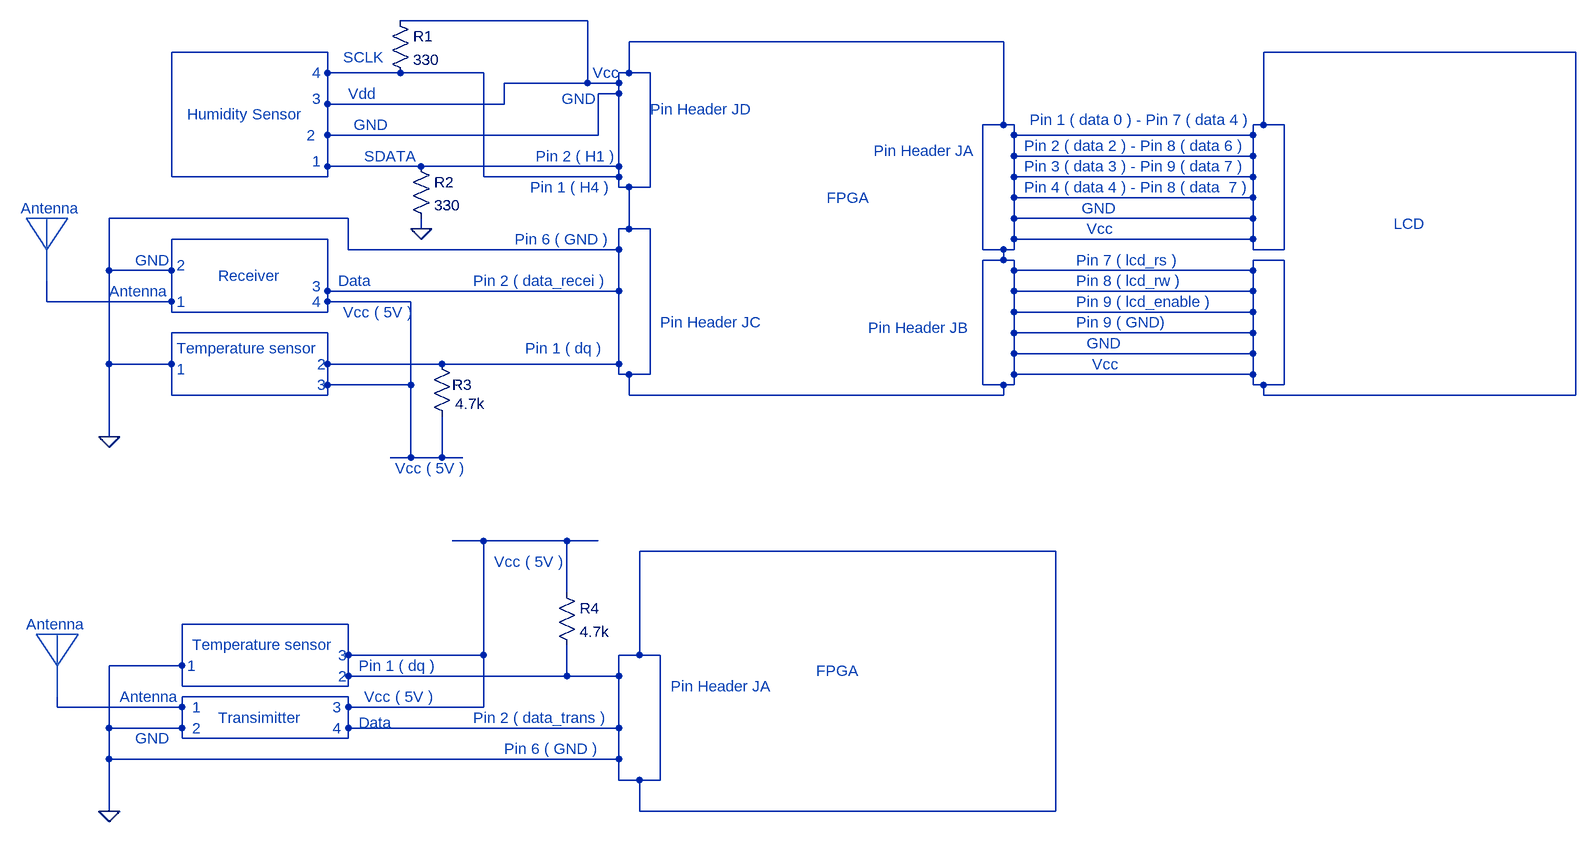
[diagram p0: schematic all_circuit_diagram.asc]
all_circuit_diagram.asc, the LTspice schematic file:
Version 4
SHEET 1 2196 1492
WIRE 672 -112 384 -112
WIRE 1312 -80 736 -80
WIRE 272 -64 32 -64
WIRE 2192 -64 1712 -64
WIRE 272 -32 272 -64
WIRE 384 -32 272 -32
WIRE 512 -32 384 -32
WIRE 736 -32 736 -80
WIRE 736 -32 720 -32
WIRE 768 -32 736 -32
WIRE 672 -16 672 -112
WIRE 672 -16 544 -16
WIRE 720 -16 720 -32
WIRE 720 -16 672 -16
WIRE 720 0 720 -16
WIRE 720 0 688 0
WIRE 272 16 272 -32
WIRE 544 16 544 -16
WIRE 544 16 272 16
WIRE 1312 48 1312 -80
WIRE 1312 48 1280 48
WIRE 1328 48 1312 48
WIRE 1712 48 1712 -64
WIRE 1712 48 1696 48
WIRE 1744 48 1712 48
WIRE 272 64 272 16
WIRE 688 64 688 0
WIRE 688 64 272 64
WIRE 1328 64 1328 48
WIRE 1696 64 1696 48
WIRE 1696 64 1328 64
WIRE 1328 96 1328 64
WIRE 1696 96 1696 64
WIRE 1696 96 1328 96
WIRE 272 112 272 64
WIRE 416 112 272 112
WIRE 720 112 720 0
WIRE 720 112 416 112
WIRE 32 128 32 -64
WIRE 272 128 272 112
WIRE 272 128 32 128
WIRE 512 128 512 -32
WIRE 720 128 720 112
WIRE 720 128 512 128
WIRE 1328 128 1328 96
WIRE 1696 128 1696 96
WIRE 1696 128 1328 128
WIRE 720 144 720 128
WIRE 736 144 720 144
WIRE 768 144 768 -32
WIRE 768 144 736 144
WIRE 1328 160 1328 128
WIRE 1696 160 1696 128
WIRE 1696 160 1328 160
WIRE 304 192 -64 192
WIRE 1328 192 1328 160
WIRE 1696 192 1696 160
WIRE 1696 192 1328 192
WIRE 416 208 416 192
WIRE 736 208 736 144
WIRE 736 208 720 208
WIRE 768 208 736 208
WIRE 272 224 32 224
WIRE 1328 224 1328 192
WIRE 1696 224 1696 192
WIRE 1696 224 1328 224
WIRE 304 240 304 192
WIRE 720 240 720 208
WIRE 720 240 304 240
WIRE 1280 240 1280 48
WIRE 1312 240 1280 240
WIRE 1328 240 1328 224
WIRE 1328 240 1312 240
WIRE 1696 240 1696 224
WIRE 1744 240 1744 48
WIRE 1744 240 1696 240
WIRE 1312 256 1312 240
WIRE 1312 256 1280 256
WIRE 1328 256 1312 256
WIRE 1744 256 1696 256
WIRE -64 272 -64 192
WIRE 32 272 32 224
WIRE 32 272 -64 272
WIRE 1328 272 1328 256
WIRE 1696 272 1696 256
WIRE 1696 272 1328 272
WIRE 272 304 272 224
WIRE 720 304 720 240
WIRE 720 304 272 304
WIRE 1328 304 1328 272
WIRE 1696 304 1696 272
WIRE 1696 304 1328 304
WIRE -160 320 -160 256
WIRE 32 320 32 272
WIRE 32 320 -160 320
WIRE 272 320 272 304
WIRE 400 320 272 320
WIRE 32 336 32 320
WIRE 272 336 272 320
WIRE 272 336 32 336
WIRE 1328 336 1328 304
WIRE 1696 336 1696 304
WIRE 1696 336 1328 336
WIRE 272 368 32 368
WIRE 1328 368 1328 336
WIRE 1696 368 1696 336
WIRE 1696 368 1328 368
WIRE 1328 400 1328 368
WIRE 1696 400 1696 368
WIRE 1696 400 1328 400
WIRE -64 416 -64 272
WIRE 32 416 32 368
WIRE 32 416 -64 416
WIRE 272 416 272 368
WIRE 448 416 272 416
WIRE 720 416 720 304
WIRE 720 416 448 416
WIRE 720 432 720 416
WIRE 736 432 720 432
WIRE 768 432 768 208
WIRE 768 432 736 432
WIRE 1328 432 1328 400
WIRE 1696 432 1696 400
WIRE 1696 432 1328 432
WIRE 272 448 272 416
WIRE 400 448 400 320
WIRE 400 448 272 448
WIRE 1280 448 1280 256
WIRE 1312 448 1280 448
WIRE 1328 448 1328 432
WIRE 1328 448 1312 448
WIRE 1696 448 1696 432
WIRE 1712 448 1696 448
WIRE 1744 448 1744 256
WIRE 1744 448 1712 448
WIRE 32 464 32 416
WIRE 272 464 272 448
WIRE 272 464 32 464
WIRE 736 464 736 432
WIRE 1312 464 1312 448
WIRE 1312 464 736 464
WIRE 1712 464 1712 448
WIRE 2192 464 2192 -64
WIRE 2192 464 1712 464
WIRE -64 528 -64 416
WIRE 400 560 400 448
WIRE 400 560 368 560
WIRE 448 560 448 496
WIRE 448 560 400 560
WIRE 480 560 448 560
WIRE 512 688 464 688
WIRE 640 688 512 688
WIRE 688 688 640 688
WIRE 1392 704 752 704
WIRE 640 768 640 688
WIRE 304 816 48 816
WIRE 304 864 304 816
WIRE 512 864 512 688
WIRE 512 864 304 864
WIRE 752 864 752 704
WIRE 752 864 720 864
WIRE 784 864 752 864
WIRE 48 880 48 816
WIRE 48 880 -64 880
WIRE 304 896 304 864
WIRE 640 896 640 848
WIRE 640 896 304 896
WIRE 720 896 720 864
WIRE 720 896 640 896
WIRE 48 912 48 880
WIRE 304 912 304 896
WIRE 304 912 48 912
WIRE 304 928 48 928
WIRE -144 944 -144 912
WIRE 48 944 48 928
WIRE 48 944 -144 944
WIRE 304 944 304 928
WIRE 512 944 512 864
WIRE 512 944 304 944
WIRE -64 976 -64 880
WIRE 48 976 48 944
WIRE 48 976 -64 976
WIRE 304 976 304 944
WIRE 720 976 720 896
WIRE 720 976 304 976
WIRE 48 992 48 976
WIRE 304 992 304 976
WIRE 304 992 48 992
WIRE -64 1024 -64 976
WIRE 720 1024 720 976
WIRE 720 1024 -64 1024
WIRE 720 1056 720 1024
WIRE 752 1056 720 1056
WIRE 784 1056 784 864
WIRE 784 1056 752 1056
WIRE -64 1104 -64 1024
WIRE 752 1104 752 1056
WIRE 1392 1104 1392 704
WIRE 1392 1104 752 1104
FLAG -64 528 0
FLAG 416 208 0
FLAG -64 1104 0
SYMBOL res 400 96 R0
SYMATTR InstName R2
SYMATTR Value 330
SYMBOL res 368 -128 R0
SYMATTR InstName R1
SYMATTR Value 330
SYMBOL res 432 400 R0
WINDOW 0 32 48 Left 2
WINDOW 3 36 77 Left 2
SYMATTR InstName R3
SYMATTR Value 4.7k
SYMBOL res 624 752 R0
SYMATTR InstName R4
SYMATTR Value 4.7k
TEXT 1040 160 Left 2 ;FPGA
TEXT 768 24 Left 2 ;Pin Header JD
TEXT 56 32 Left 2 ;Humidity Sensor
TEXT 296 -56 Left 2 ;SCLK
TEXT 328 96 Left 2 ;SDATA
TEXT 312 48 Left 2 ;GND
TEXT 304 0 Left 2 ;Vdd
TEXT 784 352 Left 2 ;Pin Header JC
TEXT 584 144 Left 2 ;Pin 1 ( H4 )
TEXT 592 96 Left 2 ;Pin 2 ( H1 )
TEXT 632 8 Left 2 ;GND
TEXT 680 -32 Left 2 ;Vcc
TEXT 1912 200 Left 2 ;LCD
TEXT 40 392 Left 2 ;Temperature sensor
TEXT 104 280 Left 2 ;Receiver
TEXT 1352 40 Left 2 ;Pin 1 ( data 0 ) - Pin 7 ( data 4 )
TEXT 1112 88 Left 2 ;Pin Header JA
TEXT 1432 176 Left 2 ;GND
TEXT 1440 208 Left 2 ;Vcc
TEXT 1344 144 Left 2 ;Pin 4 ( data 4 ) - Pin 8 ( data  7 )
TEXT 1344 112 Left 2 ;Pin 3 ( data 3 ) - Pin 9 ( data 7 )
TEXT 1344 80 Left 2 ;Pin 2 ( data 2 ) - Pin 8 ( data 6 )
TEXT 1424 256 Left 2 ;Pin 7 ( lcd_rs )
TEXT 1440 384 Left 2 ;GND
TEXT 1448 416 Left 2 ;Vcc
TEXT 1104 360 Left 2 ;Pin Header JB
TEXT 1424 288 Left 2 ;Pin 8 ( lcd_rw )
TEXT 1424 320 Left 2 ;Pin 9 ( lcd_enable )
TEXT 1424 352 Left 2 ;Pin 9 ( GND)
TEXT 1024 888 Left 2 ;FPGA
TEXT 800 912 Left 2 ;Pin Header JA
TEXT 104 960 Left 2 ;Transimitter
TEXT 64 848 Left 2 ;Temperature sensor
TEXT 320 880 Left 2 ;Pin 1 ( dq )
TEXT 576 392 Left 2 ;Pin 1 ( dq )
TEXT 376 576 Left 2 ;Vcc ( 5V )
TEXT 528 720 Left 2 ;Vcc ( 5V )
TEXT 328 928 Left 2 ;Vcc ( 5V )
TEXT 544 1008 Left 2 ;Pin 6 ( GND )
TEXT 296 336 Left 2 ;Vcc ( 5V )
TEXT 496 288 Left 2 ;Pin 2 ( data_recei )
TEXT -200 176 Left 2 ;Antenna
TEXT -192 816 Left 2 ;Antenna
TEXT 496 960 Left 2 ;Pin 2 ( data_trans )
TEXT 560 224 Left 2 ;Pin 6 ( GND )
TEXT 248 104 Left 2 ;1
TEXT 240 64 Left 2 ;2
TEXT 248 8 Left 2 ;3
TEXT 248 -32 Left 2 ;4
TEXT 40 424 Left 2 ;1
TEXT 256 416 Left 2 ;2
TEXT 256 448 Left 2 ;3
TEXT 56 880 Left 2 ;1
TEXT 288 864 Left 2 ;3
TEXT 288 896 Left 2 ;2
TEXT 64 944 Left 2 ;1
TEXT 64 976 Left 2 ;2
TEXT 280 944 Left 2 ;3
TEXT 280 976 Left 2 ;4
TEXT -24 992 Left 2 ;GND
TEXT -48 928 Left 2 ;Antenna
TEXT 320 968 Left 2 ;Data
TEXT 40 264 Left 2 ;2
TEXT 40 320 Left 2 ;1
TEXT 248 296 Left 2 ;3
TEXT 248 320 Left 2 ;4
TEXT -64 304 Left 2 ;Antenna
TEXT -24 256 Left 2 ;GND
TEXT 288 288 Left 2 ;Data
LINE Normal -128 192 -176 192
LINE Normal -160 240 -128 192
LINE Normal -192 192 -160 240
LINE Normal -176 192 -192 192
LINE Normal -160 192 -176 192 2
LINE Normal -160 288 -160 192
LINE Normal -112 832 -160 832
LINE Normal -144 880 -112 832
LINE Normal -176 832 -144 880
LINE Normal -160 832 -176 832
LINE Normal -144 832 -160 832 2
LINE Normal -144 928 -144 832

The netlist it stands for:
* all_circuit_diagram.asc
R2 0 0 330
R1 0 0 330
R3 0 0 4.7k
R4 0 0 4.7k
* FPGA
* Pin Header JD
* Humidity Sensor
* SCLK
* SDATA
* GND
* Vdd
* Pin Header JC
* Pin 1 ( H4 )
* Pin 2 ( H1 )
* GND
* Vcc
* LCD
* Temperature sensor
* Receiver
* Pin 1 ( data 0 ) - Pin 7 ( data 4 )
* Pin Header JA
* GND
* Vcc
* Pin 4 ( data 4 ) - Pin 8 ( data  7 )
* Pin 3 ( data 3 ) - Pin 9 ( data 7 )
* Pin 2 ( data 2 ) - Pin 8 ( data 6 )
* Pin 7 ( lcd_rs )
* GND
* Vcc
* Pin Header JB
* Pin 8 ( lcd_rw )
* Pin 9 ( lcd_enable )
* Pin 9 ( GND)
* FPGA
* Pin Header JA
* Transimitter
* Temperature sensor
* Pin 1 ( dq )
* Pin 1 ( dq )
* Vcc ( 5V )
* Vcc ( 5V )
* Vcc ( 5V )
* Pin 6 ( GND )
* Vcc ( 5V )
* Pin 2 ( data_recei )
* Antenna
* Antenna
* Pin 2 ( data_trans )
* Pin 6 ( GND )
* 1
* 2
* 3
* 4
* 1
* 2
* 3
* 1
* 3
* 2
* 1
* 2
* 3
* 4
* GND
* Antenna
* Data
* 2
* 1
* 3
* 4
* Antenna
* GND
* Data
.backanno
.end